# Altium project VBT6.PrjPCB
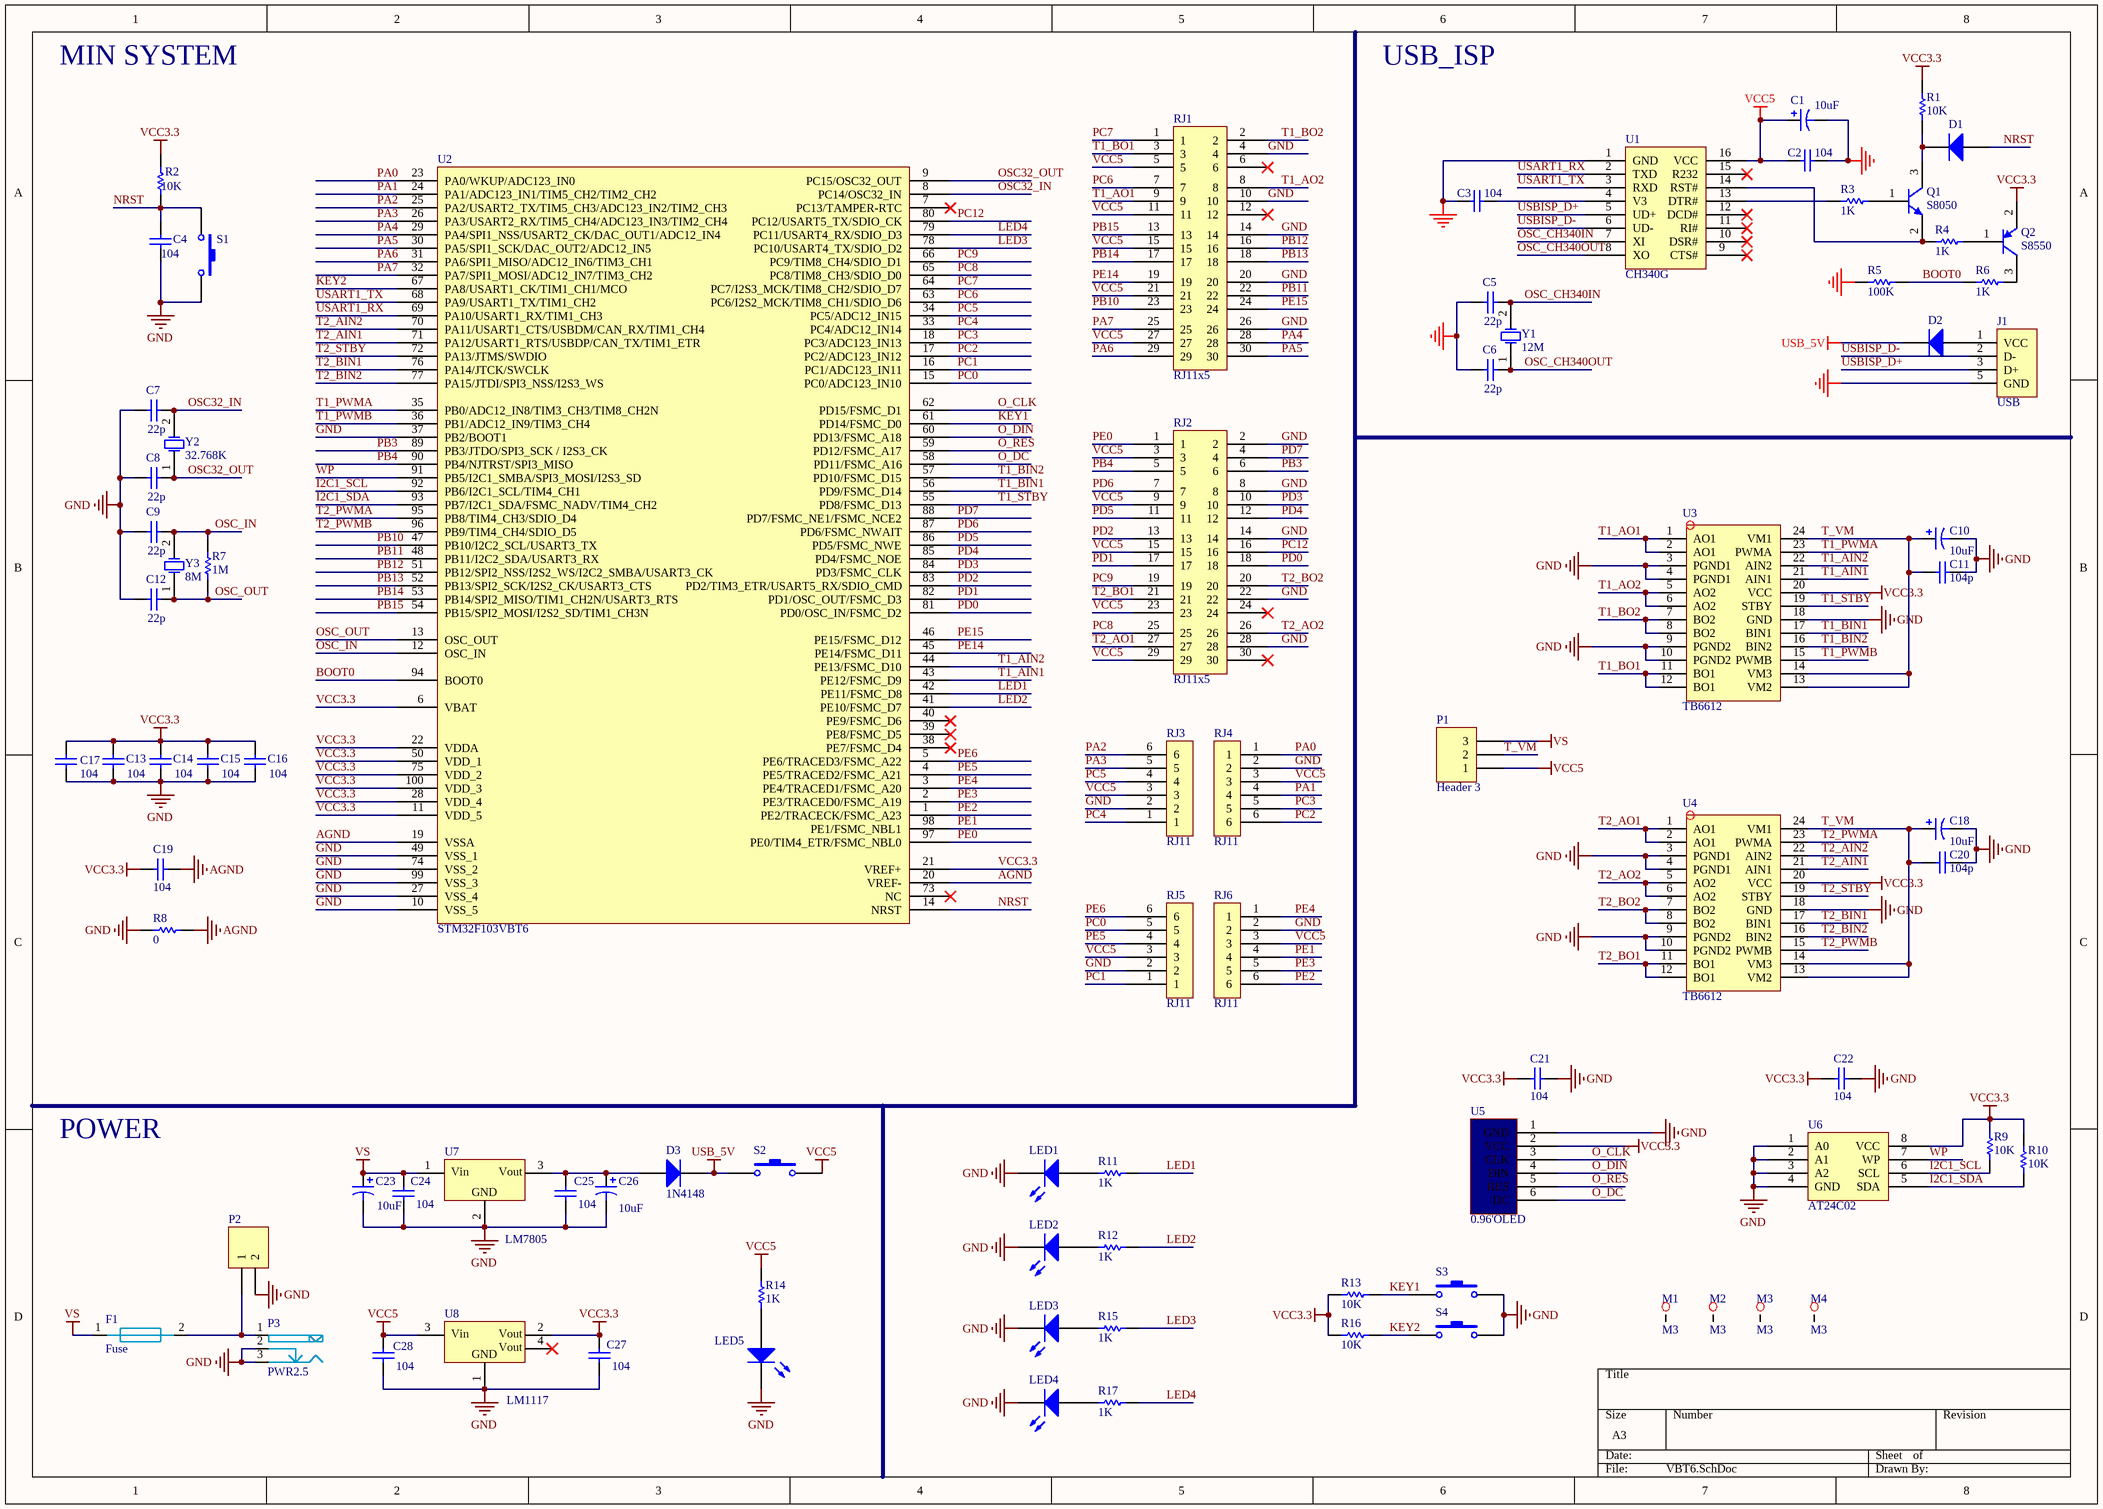
[diagram p0: VBT6.SchDoc]
1 sheet, 85 parts. Net scope: global (net labels, ports and power ports of the same name join across sheets).
Board file: VBT6.PcbDoc

## Sheet VBT6.SchDoc
size A3

### Parts
C1  value 10uF  [3528]  (hidden comment: Cap Pol3)
C2  value 104  [0603_C]  (hidden comment: Cap)
C3  value 104  [0603_C]  (hidden comment: Cap)
C4  value 104  [0603_C]  (hidden comment: Cap)
C5  value 22p  [0603_C]  (hidden comment: Cap)
C6  value 22p  [0603_C]  (hidden comment: Cap)
C7  value 22p  [0603_C]  (hidden comment: Cap)
C8  value 22p  [0603_C]  (hidden comment: Cap)
C9  value 22p  [0603_C]  (hidden comment: Cap)
C10  value 10uF  [电解电容]  (hidden comment: Cap Pol3)
C11  value 104p  [0603_C]  (hidden comment: Cap)
C12  value 22p  [0603_C]  (hidden comment: Cap)
C13  value 104  [0603_C]  (hidden comment: Cap)
C14  value 104  [0603_C]  (hidden comment: Cap)
C15  value 104  [0603_C]  (hidden comment: Cap)
C16  value 104  [0603_C]  (hidden comment: Cap)
C17  value 104  [0603_C]  (hidden comment: Cap)
C18  value 10uF  [电解电容]  (hidden comment: Cap Pol3)
C19  value 104  [0603_C]  (hidden comment: Cap)
C20  value 104p  [0603_C]  (hidden comment: Cap)
C21  value 104  [0603_C]  (hidden comment: Cap)
C22  value 104  [0603_C]  (hidden comment: Cap)
C23  value 10uF  [3528]  (hidden comment: Cap Pol3)
C24  value 104  [0603_C]  (hidden comment: Cap)
C25  value 104  [0603_C]  (hidden comment: Cap)
C26  value 10uF  [3528]  (hidden comment: Cap Pol3)
C27  value 104  [0603_C]  (hidden comment: Cap)
C28  value 104  [0603_C]  (hidden comment: Cap)
D1  Diode 1N4001  [SS24]  (value not drawn)
D2  4148  [SS24]  (value not drawn)
D3  1N4148  [SS24]
F1  Fuse  [SMD-1812]
J1  USB  [MINIUSB]
LED1  LED0  [LED-3mm]  (value not drawn)
LED2  LED0  [LED-3mm]  (value not drawn)
LED3  LED0  [LED-3mm]  (value not drawn)
LED4  LED0  [LED-3mm]  (value not drawn)
LED5  LED0  [LED-3mm]  (value not drawn)
M1  M3  [M3*8]
M2  M3  [M3*8]
M3  M3  [M3*8]
M4  M3  [M3*8]
P1  Header 3  [HDR1X3]
P2  Header 2  [PWRin]  (value not drawn)
P3  PWR2.5  [DC_002]
Q1  S8050  [SOT-23-3L]
Q2  S8550  [SOT-23-3L]
R1  value 10K  [0603_R]  (hidden comment: Res1)
R2  value 10K  [0603_R]  (hidden comment: Res1)
R3  value 1K  [0603_R]  (hidden comment: Res1)
R4  value 1K  [0603_R]  (hidden comment: Res1)
R5  value 100K  [0603_R]  (hidden comment: Res1)
R6  value 1K  [0603_R]  (hidden comment: Res1)
R7  value 1M  [0603_R]  (hidden comment: Res1)
R8  value 0  [0603_R]  (hidden comment: Res1)
R9  value 10K  [0603_R]  (hidden comment: Res1)
R10  value 10K  [0603_R]  (hidden comment: Res1)
R11  value 1K  [0603_R]  (hidden comment: Res1)
R12  value 1K  [0603_R]  (hidden comment: Res1)
R13  value 10K  [0603_R]  (hidden comment: Res1)
R14  value 1K  [0603_R]  (hidden comment: Res1)
R15  value 1K  [0603_R]  (hidden comment: Res1)
R16  value 10K  [0603_R]  (hidden comment: Res1)
R17  value 1K  [0603_R]  (hidden comment: Res1)
RJ1  RJ11x5  [RJ11x5]
RJ2  RJ11x5  [RJ11x5]
RJ3  RJ11  [RJ11]
RJ4  RJ11  [RJ11]
RJ5  RJ11  [RJ11]
RJ6  RJ11  [RJ11]
S1  K1  [KEY_DIP]  (value not drawn)
S2  K1  [SMTS-102C3]  (value not drawn)
S3  K1  [KEY_DIP]  (value not drawn)
S4  K1  [KEY_DIP]  (value not drawn)
U1  CH340G  [CH340G]
U2  STM32F103VBT6  [STM32F103CVBT6]
U3  TB6612  [SSOP-24]
U4  TB6612  [SSOP-24]
U5  0.96'OLED  [OLED]
U6  AT24C02  [SO-8]
U7  LM7805  [TO-252]
U8  LM1117  [LM117]
Y1  12M  [XTAL12M]
Y2  32.768K  [XTAL32.768K]
Y3  8M  [XTAL12M]

### Nets
AGND: C19.1 R8.2 U2.19(VSSA) U2.20(VREF-)
GND: C1.2 C2.2 C3.1 C4.1 C5.2 C6.2 C7.1 C8.2 C9.2 C10.2 C11.1 C12.2 C13.1 C14.1 C15.1 C16.1 C17.1 C18.2 C20.1 C21.1 C22.1 C23.2 C24.1 C25.1 C26.2 C27.1 C28.1 J1.5(GND) LED1.2(K) LED2.2(K) LED3.2(K) LED4.2(K) LED5.2(K) P2.2 P3.2 P3.3 R5.1 R8.1 RJ1.4 RJ1.10 RJ1.14 RJ1.20 RJ1.26 RJ2.2 RJ2.8 RJ2.14 RJ2.22 RJ2.28 RJ3.2 RJ4.2 RJ5.2 RJ6.2 S1.2 S3.2 S4.2 U1.1(GND) U2.10(VSS_5) U2.27(VSS_4) U2.37(PB2/BOOT1) U2.49(VSS_1) U2.74(VSS_2) U2.99(VSS_3) U3.3(PGND1) U3.4(PGND1) U3.9(PGND2) U3.10(PGND2) U3.18(GND) U4.3(PGND1) U4.4(PGND1) U4.9(PGND2) U4.10(PGND2) U4.18(GND) U5.1(GND) U6.1(A0) U6.2(A1) U6.3(A2) U6.4(GND) U7.2(GND) U8.1(GND)
USB_5V: D2.2(K) D3.2(K) S2.1
VCC3.3: C13.2 C14.2 C15.2 C16.2 C17.2 C19.2 C21.2 C22.2 C27.2 Q2.2(E) R1.1 R2.2 R9.1 R10.1 R13.1 R16.1 U2.6(VBAT) U2.11(VDD_5) U2.21(VREF+) U2.22(VDDA) U2.28(VDD_4) U2.50(VDD_1) U2.75(VDD_2) U2.100(VDD_3) U3.20(VCC) U4.20(VCC) U5.2(VCC) U6.8(VCC) U8.2(OUT)
VCC5: C1.1 C2.1 C28.2 P1.1 R14.2 RJ1.5 RJ1.11 RJ1.15 RJ1.21 RJ1.27 RJ2.3 RJ2.9 RJ2.15 RJ2.23 RJ2.29 RJ3.3 RJ4.3 RJ5.3 RJ6.3 S2.2 U1.16(VCC) U8.3(IN)
VS: C23.1 C24.2 F1.1 P1.3 U7.1(IN)
BOOT0: R5.2 R6.2 U2.94(BOOT0)
I2C1_SCL: R9.2 U2.92(PB6/I2C1_SCL/TIM4_CH1) U6.6(SCL)
I2C1_SDA: R10.2 U2.93(PB7/I2C1_SDA/FSMC_NADV/TIM4_CH2) U6.5(SDA)
KEY1: R13.2 S3.1 U2.61(PD14/FSMC_D0)
KEY2: R16.2 S4.1 U2.67(PA8/USART1_CK/TIM1_CH1/MCO)
LED1: R11.2 U2.42(PE11/FSMC_D8)
LED2: R12.2 U2.41(PE10/FSMC_D7)
LED3: R15.2 U2.78(PC10/USART4_TX/SDIO_D2)
LED4: R17.2 U2.79(PC11/USART4_RX/SDIO_D3)
NRST: C4.2 D1.1(A) R2.1 S1.1 U2.14(NRST)
O_CLK: U2.62(PD15/FSMC_D1) U5.3(CLK)
O_DC: U2.58(PD11/FSMC_A16) U5.6(DC)
O_DIN: U2.60(PD13/FSMC_A18) U5.4(DIN)
O_RES: U2.59(PD12/FSMC_A17) U5.5(RES)
OSC32_IN: C7.2 U2.8(PC14/OSC32_IN) Y2.2(OSC2)
OSC32_OUT: C8.1 U2.9(PC15/OSC32_OUT) Y2.1(OSC1)
OSC_CH340IN: C5.1 U1.7(XI) Y1.2(OSC2)
OSC_CH340OUT: C6.1 U1.8(XO) Y1.1(OSC1)
OSC_IN: C9.1 R7.1 U2.12(OSC_IN) Y3.2(OSC2)
OSC_OUT: C12.1 R7.2 U2.13(OSC_OUT) Y3.1(OSC1)
PA0: RJ4.1 U2.23(PA0/WKUP/ADC123_IN0)
PA1: RJ4.4 U2.24(PA1/ADC123_IN1/TIM5_CH2/TIM2_CH2)
PA2: RJ3.6 U2.25(PA2/USART2_TX/TIM5_CH3/ADC123_IN2/TIM2_CH3)
PA3: RJ3.5 U2.26(PA3/USART2_RX/TIM5_CH4/ADC123_IN3/TIM2_CH4)
PA4: RJ1.28 U2.29(PA4/SPI1_NSS/USART2_CK/DAC_OUT1/ADC12_IN4)
PA5: RJ1.30 U2.30(PA5/SPI1_SCK/DAC_OUT2/ADC12_IN5)
PA6: RJ1.29 U2.31(PA6/SPI1_MISO/ADC12_IN6/TIM3_CH1)
PA7: RJ1.25 U2.32(PA7/SPI1_MOSI/ADC12_IN7/TIM3_CH2)
PB3: RJ2.6 U2.89(PB3/JTDO/SPI3_SCK_/_I2S3_CK)
PB4: RJ2.5 U2.90(PB4/NJTRST/SPI3_MISO)
PB10: RJ1.23 U2.47(PB10/I2C2_SCL/USART3_TX)
PB11: RJ1.22 U2.48(PB11/I2C2_SDA/USART3_RX)
PB12: RJ1.16 U2.51(PB12/SPI2_NSS/I2S2_WS/I2C2_SMBA/USART3_CK)
PB13: RJ1.18 U2.52(PB13/SPI2_SCK/I2S2_CK/USART3_CTS)
PB14: RJ1.17 U2.53(PB14/SPI2_MISO/TIM1_CH2N/USART3_RTS)
PB15: RJ1.13 U2.54(PB15/SPI2_MOSI/I2S2_SD/TIM1_CH3N)
PC0: RJ5.5 U2.15(PC0/ADC123_IN10)
PC1: RJ5.1 U2.16(PC1/ADC123_IN11)
PC2: RJ4.6 U2.17(PC2/ADC123_IN12)
PC3: RJ4.5 U2.18(PC3/ADC123_IN13)
PC4: RJ3.1 U2.33(PC4/ADC12_IN14)
PC5: RJ3.4 U2.34(PC5/ADC12_IN15)
PC6: RJ1.7 U2.63(PC6/I2S2_MCK/TIM8_CH1/SDIO_D6)
PC7: RJ1.1 U2.64(PC7/I2S3_MCK/TIM8_CH2/SDIO_D7)
PC8: RJ2.25 U2.65(PC8/TIM8_CH3/SDIO_D0)
PC9: RJ2.19 U2.66(PC9/TIM8_CH4/SDIO_D1)
PC12: RJ2.16 U2.80(PC12/USART5_TX/SDIO_CK)
PD0: RJ2.18 U2.81(PD0/OSC_IN/FSMC_D2)
PD1: RJ2.17 U2.82(PD1/OSC_OUT/FSMC_D3)
PD2: RJ2.13 U2.83(PD2/TIM3_ETR/USART5_RX/SDIO_CMD)
PD3: RJ2.10 U2.84(PD3/FSMC_CLK)
PD4: RJ2.12 U2.85(PD4/FSMC_NOE)
PD5: RJ2.11 U2.86(PD5/FSMC_NWE)
PD6: RJ2.7 U2.87(PD6/FSMC_NWAIT)
PD7: RJ2.4 U2.88(PD7/FSMC_NE1/FSMC_NCE2)
PE0: RJ2.1 U2.97(PE0/TIM4_ETR/FSMC_NBL0)
PE1: RJ6.4 U2.98(PE1/FSMC_NBL1)
PE2: RJ6.6 U2.1(PE2/TRACECK/FSMC_A23)
PE3: RJ6.5 U2.2(PE3/TRACED0/FSMC_A19)
PE4: RJ6.1 U2.3(PE4/TRACED1/FSMC_A20)
PE5: RJ5.4 U2.4(PE5/TRACED2/FSMC_A21)
PE6: RJ5.6 U2.5(PE6/TRACED3/FSMC_A22)
PE14: RJ1.19 U2.45(PE14/FSMC_D11)
PE15: RJ1.24 U2.46(PE15/FSMC_D12)
T1_AIN1: U2.43(PE12/FSMC_D9) U3.21(AIN1)
T1_AIN2: U2.44(PE13/FSMC_D10) U3.22(AIN2)
T1_AO1: RJ1.9 U3.1(AO1) U3.2(AO1)
T1_AO2: RJ1.8 U3.5(AO2) U3.6(AO2)
T1_BIN1: U2.56(PD9/FSMC_D14) U3.17(BIN1)
T1_BIN2: U2.57(PD10/FSMC_D15) U3.16(BIN2)
T1_BO1: RJ1.3 U3.11(BO1) U3.12(BO1)
T1_BO2: RJ1.2 U3.7(BO2) U3.8(BO2)
T1_PWMA: U2.35(PB0/ADC12_IN8/TIM3_CH3/TIM8_CH2N) U3.23(PWMA)
T1_PWMB: U2.36(PB1/ADC12_IN9/TIM3_CH4) U3.15(PWMB)
T1_STBY: U2.55(PD8/FSMC_D13) U3.19(STBY)
T2_AIN1: U2.71(PA12/USART1_RTS/USBDP/CAN_TX/TIM1_ETR) U4.21(AIN1)
T2_AIN2: U2.70(PA11/USART1_CTS/USBDM/CAN_RX/TIM1_CH4) U4.22(AIN2)
T2_AO1: RJ2.27 U4.1(AO1) U4.2(AO1)
T2_AO2: RJ2.26 U4.5(AO2) U4.6(AO2)
T2_BIN1: U2.76(PA14/JTCK/SWCLK) U4.17(BIN1)
T2_BIN2: U2.77(PA15/JTDI/SPI3_NSS/I2S3_WS) U4.16(BIN2)
T2_BO1: RJ2.21 U4.11(BO1) U4.12(BO1)
T2_BO2: RJ2.20 U4.7(BO2) U4.8(BO2)
T2_PWMA: U2.95(PB8/TIM4_CH3/SDIO_D4) U4.23(PWMA)
T2_PWMB: U2.96(PB9/TIM4_CH4/SDIO_D5) U4.15(PWMB)
T2_STBY: U2.72(PA13/JTMS/SWDIO) U4.19(STBY)
T_VM: C10.1 C11.2 C18.1 C20.2 P1.2 U3.13(VM2) U3.14(VM3) U3.24(VM1) U4.13(VM2) U4.14(VM3) U4.24(VM1)
USART1_RX: U1.2(TXD) U2.69(PA10/USART1_RX/TIM1_CH3)
USART1_TX: U1.3(RXD) U2.68(PA9/USART1_TX/TIM1_CH2)
USBISP_D+: J1.3(D+) U1.5(UD+)
USBISP_D-: J1.2(D-) U1.6(UD-)
WP: U2.91(PB5/I2C1_SMBA/SPI3_MOSI/I2S3_SD) U6.7(WP)
NetC3_2: C3.2 U1.4(V3)
NetC25_2: C25.2 C26.1 D3.1(A) U7.3(OUT)
NetD1_2: D1.2(K) Q1.3(C) R1.2
NetD2_1: D2.1(A) J1.1(VCC)
NetF1_2: F1.2 P2.1 P3.1
NetLED1_1: LED1.1(A) R11.1
NetLED2_1: LED2.1(A) R12.1
NetLED3_1: LED3.1(A) R15.1
NetLED4_1: LED4.1(A) R17.1
NetLED5_1: LED5.1(A) R14.1
NetQ1_1: Q1.1(B) R3.1
NetQ1_2: Q1.2(E) R4.2 U1.14(RST#)
NetQ2_1: Q2.1(B) R4.1
NetQ2_3: Q2.3(C) R6.1
NetR3_2: R3.2 U1.13(DTR#)

Not connected (* = marked no-connect by the designer): M1 0; M2 0; M3 0; M4 0; RJ1 6* 12*; RJ2 24* 30*; U1 9(CTS#)* 10(DSR#)* 11(RI#)* 12(DCD#)* 15(R232)*; U2 7(PC13/TAMPER-RTC)* 38(PE7/FSMC_D4)* 39(PE8/FSMC_D5)* 40(PE9/FSMC_D6)* 73(NC)*; U8 4(OUT)*

### Notes on the sheet
- MIN SYSTEM
- USB_ISP
- POWER
- (in symbol LM117) Vin; Vout
- (in symbol LM7805) Vin; Vout

### Library data of the parts
C1 C10 C18 C23 C26 = Cap Pol3: Polarized Capacitor (Surface Mount); Published: 8-Jun-2000; LatestRevisionDate: 29-May-2009; LatestRevisionNote: IPC-7351 Footprint Added.; PackageReference: C0805; Publisher: Altium Limited; PackageDescription: Chip Capacitor
C2-C9 C11-C17 C19-C22 C24 C25 C27 C28 = Cap: Capacitor; Published: 8-Jun-2000; LatestRevisionDate: 17-Jul-2002; LatestRevisionNote: Re-released for DXP Platform.; PackageReference: RAD-0.3; Publisher: Altium Limited
D1 D3 = Diode 1N4001: 1 Amp General Purpose Rectifier; value: 1N4001贴片 SMA封装; Published: 8-Jun-2000; LatestRevisionDate: 17-Jul-2002; LatestRevisionNote: Re-released for DXP Platform.; DatasheetVersion: 1998; PackageVersion: Aug-1999; PackageReference: DO-41; Publisher: Altium Limited; Code_JEDEC: DO-204-AL; ComponentLink1Description: Manufacturer Link; ComponentLink1URL: http://www.fairchildsemi.com/; ComponentLink2Description: Datasheet; ComponentLink2URL: http://www.fairchildsemi.com/ds/1N%2F1N4001.pdf
D2 = Diode 1N4148: High Conductance Fast Diode; Published: 8-Jun-2000; LatestRevisionDate: 17-Jul-2002; LatestRevisionNote: Re-released for DXP Platform.; DatasheetVersion: 1997; PackageReference: DO-35; Publisher: Altium Limited; Code_JEDEC: DO-204-AH; ComponentLink1Description: Manufacturer Link; ComponentLink1URL: http://www.fairchildsemi.com/; ComponentLink2Description: Datasheet; ComponentLink2URL: http://www.fairchildsemi.com/ds/1N%2F1N4148.pdf
J1 = Header 4: Header, 4-Pin; LatestRevisionDate: 17-Jul-2002; LatestRevisionNote: Re-released for DXP Platform.; Publisher: Altium Limited
LED1-LED5 = LED1: Typical RED GaAs LED; value: 3MM LED; Published: 8-Jun-2000; LatestRevisionDate: 08-Jul-2005; LatestRevisionNote: Mech Layer 1 removed.; PackageReference: LED-1; Publisher: Altium Limited
P1 = Header 3: Header, 3-Pin; LatestRevisionDate: 17-Jul-2002; LatestRevisionNote: Re-released for DXP Platform.; Publisher: Altium Limited
P2 = Header 2: Header, 2-Pin; LatestRevisionDate: 17-Jul-2002; LatestRevisionNote: Re-released for DXP Platform.; Publisher: Altium Limited
Q1 = 2N3904: NPN General Purpose Amplifier; value: 贴片三极管 S8050 SOT-23封装; Published: 8-Jun-2000; LatestRevisionDate: 15-Jan-2003; LatestRevisionNote: PCB Footprint 'BCY-W3/D4.7' replaced; DatasheetVersion: 1997; PackageVersion: Sep-1998; PackageReference: TO-92A; Publisher: Altium Limited; Code_JEDEC: TO-92A; ComponentLink1Description: Manufacturer Link; ComponentLink1URL: http://www.fairchildsemi.com/; ComponentLink2Description: Datasheet; ComponentLink2URL: http://www.fairchildsemi.com/ds/2N%2F2N3904.pdf
Q2 = 2N3906: PNP General Purpose Amplifier; value: 贴片三极管 S8550 SOT-23封装; Published: 8-Jun-2000; LatestRevisionDate: 15-Jan-2003; LatestRevisionNote: PCB Footprint 'BCY-W3/D4.7' replaced; DatasheetVersion: 1997; PackageVersion: Sep-1998; PackageReference: TO-92A; Publisher: Altium Limited; Code_JEDEC: TO-92A; ComponentLink1Description: Manufacturer Link; ComponentLink1URL: http://www.fairchildsemi.com/; ComponentLink2Description: Datasheet; ComponentLink2URL: http://www.fairchildsemi.com/ds/2N%2F2N3906.pdf
R1-R17 = Res1: Resistor; Published: 8-Jun-2000; LatestRevisionDate: 17-Jul-2002; LatestRevisionNote: Re-released for DXP Platform.; PackageReference: AXIAL-0.3; Publisher: Altium Limited
S1-S4 = SW-PB: Switch; Published: 24-Mar-1999; LatestRevisionDate: 17-Jul-2002; LatestRevisionNote: Re-released for DXP Platform.; PackageReference: SPST-2; Publisher: Altium Limited
U8 = LM117
Y1 = XTAL: Crystal Oscillator; Published: 8-Jun-2000; LatestRevisionDate: 17-Jul-2002; LatestRevisionNote: Re-released for DXP Platform.; PackageReference: R38; Publisher: Altium Limited; value: 12M
Y2 = XTAL: Crystal Oscillator; value: 32.768Khz; Published: 8-Jun-2000; LatestRevisionDate: 17-Jul-2002; LatestRevisionNote: Re-released for DXP Platform.; PackageReference: R38; Publisher: Altium Limited
Y3 = XTAL: Crystal Oscillator; value: 12M; Published: 8-Jun-2000; LatestRevisionDate: 17-Jul-2002; LatestRevisionNote: Re-released for DXP Platform.; PackageReference: R38; Publisher: Altium Limited